# Altium schematic sheet JQ6500-16P-V1.3.SchDoc
size A3
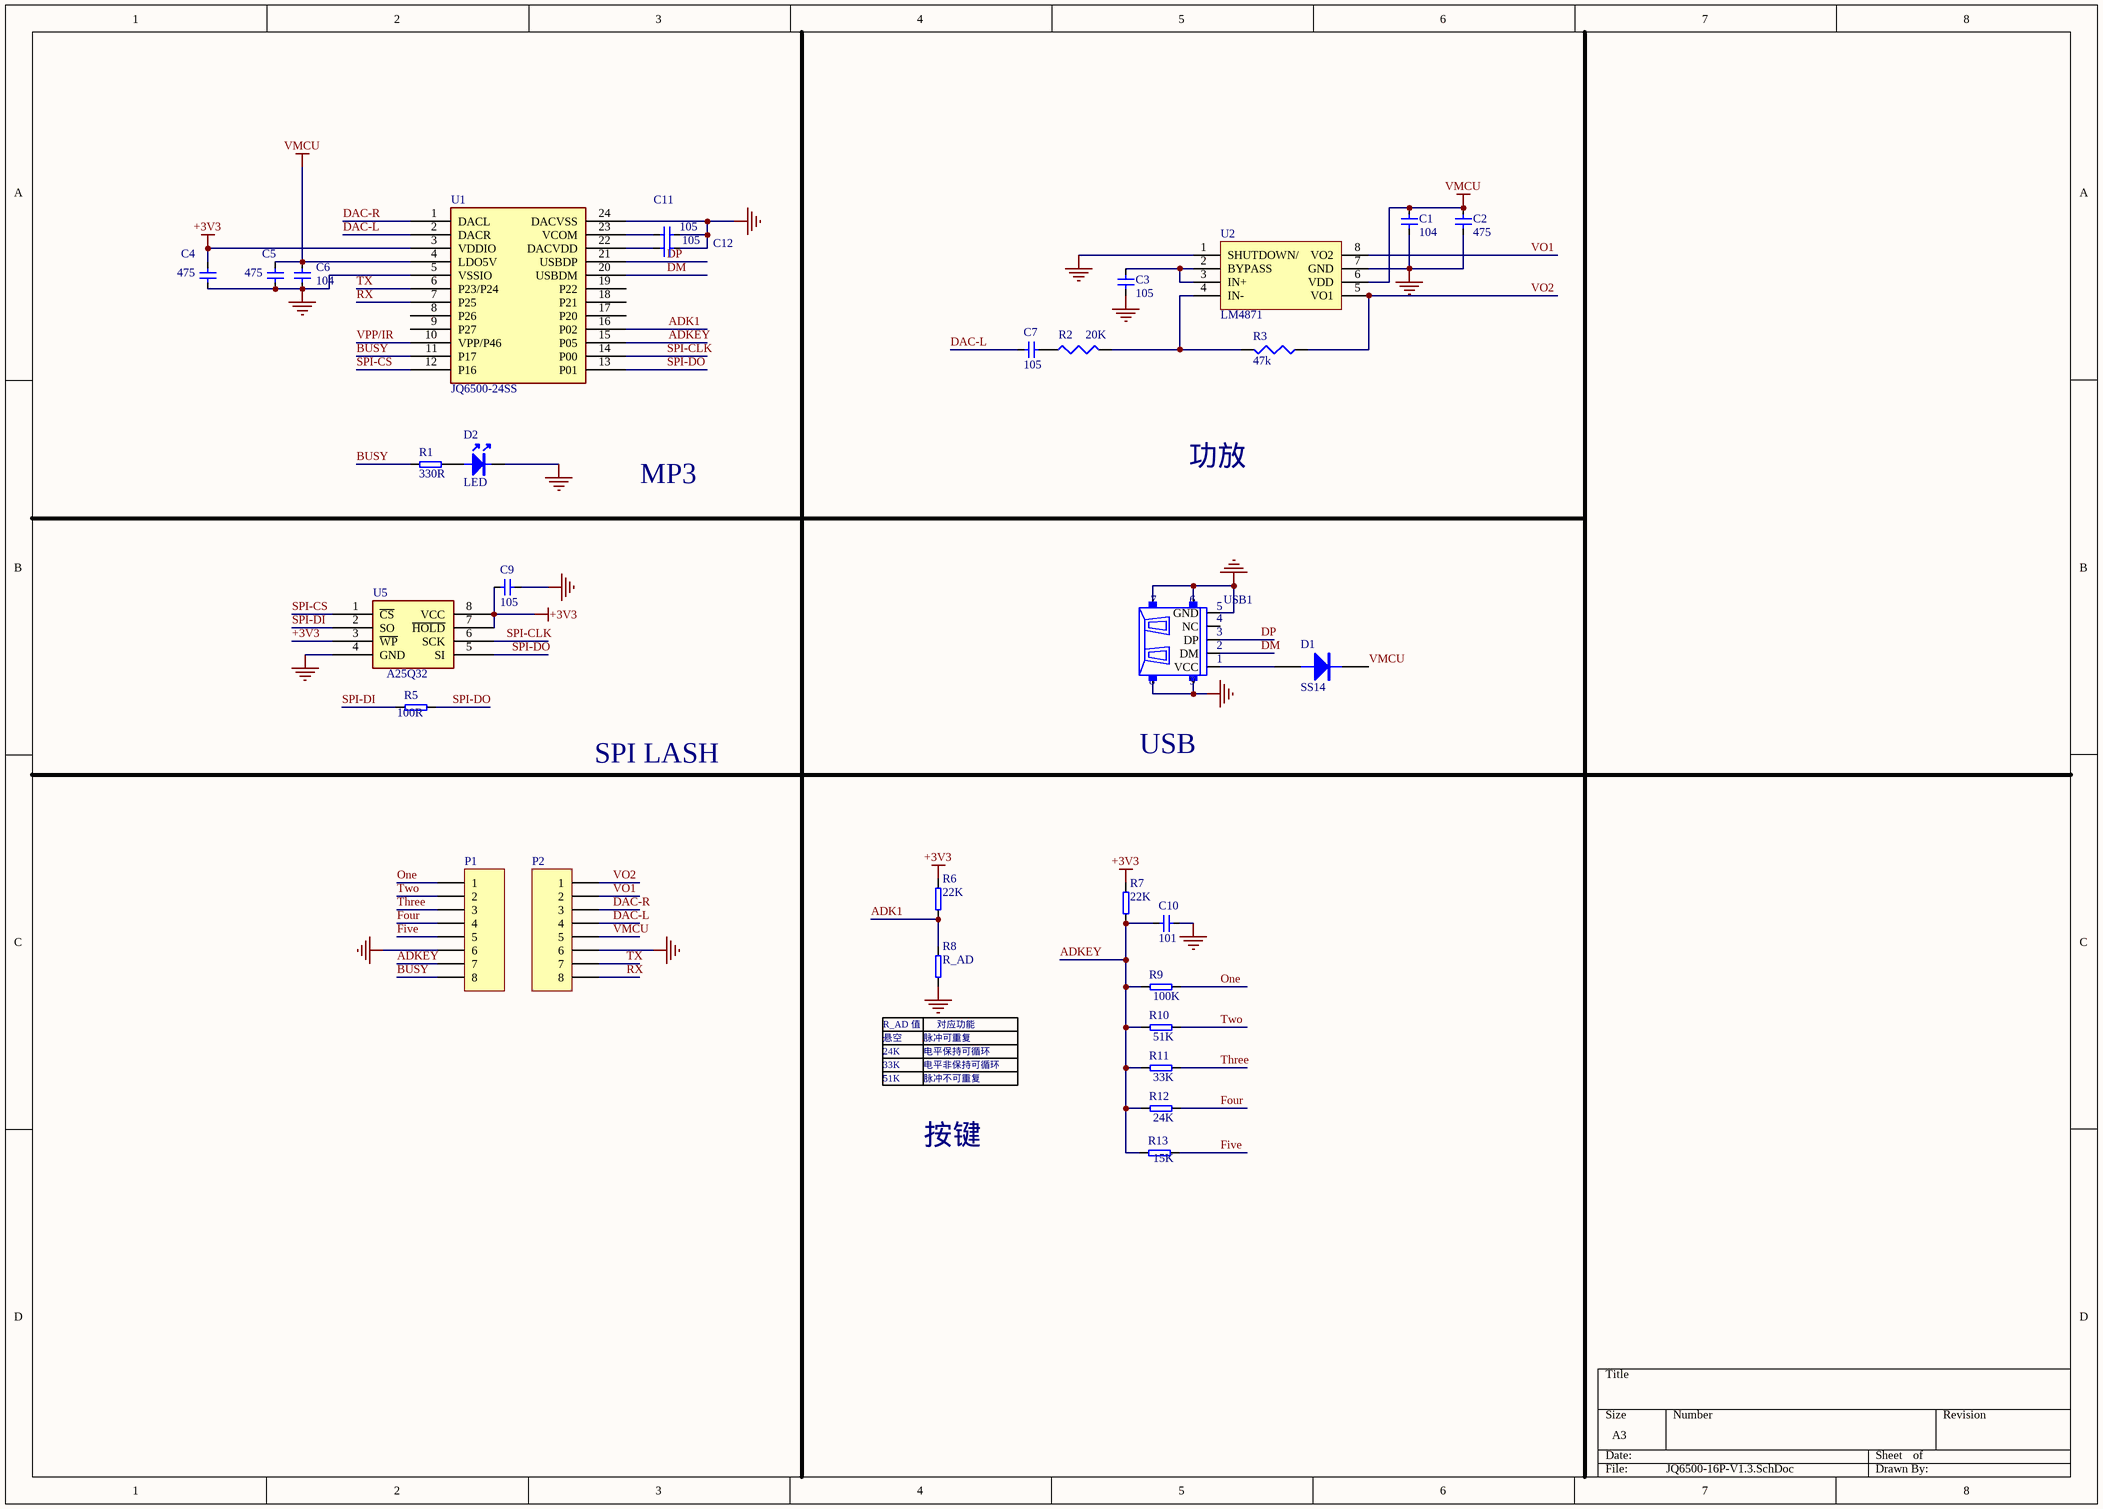
[diagram p0: JQ6500-16P-V1.3.SchDoc]

## Parts
C1  104  [C0603]
C2  475  [C0603]
C3  105  [C0603]
C4  475  [C0603]
C5  475  [C0603]
C6  104  [C0603]
C7  105  [C0603]
C9  105  [C0603]
C10  101  [C0603]
C11  105  [C0603]
C12  105  [C0603]
D1  SS14  [SOD123-1]
D2  LED  [0603]
P1  Header 8  [HDR1X8]  (value not drawn)
P2  Header 8  [HDR1X8]  (value not drawn)
R1  330R  [R0603]
R2  20K  [R0603]
R3  47k  [R0603]
R5  100R  [R0603]
R6  22K  [R0603]
R7  22K  [R0603]
R8  R_AD  [R0603]
R9  100K  [R0603]
R10  51K  [R0603]
R11  33K  [R0603]
R12  24K  [R0603]
R13  15K  [R0603]
U1  JQ6500-24SS  [SSOP24]
U2  LM4871  [SOP_8]
U5  A25Q32  [W25X16]
USB1  USB-5PIN  [USB-5PIN]  (value not drawn)

## Nets
+3V3: C4.1 C9.1 R6.2 R7.2 U1.3(VDDIO) U5.3(~{WP}) U5.7(~{HOLD}) U5.8(VCC)
GND: C1.1 C2.1 C3.1 C4.2 C5.2 C6.2 C9.2 C10.1 C11.2 C12.1 D2.2 P1.6 P2.6 R8.1 U1.5(VSSIO) U1.24(DACVSS) U2.1(SHUTDOWN/) U2.7(GND) U5.4(GND) USB1.5(GND) USB1.6 USB1.7 USB1.8 USB1.9
VMCU: C1.2 C2.2 C5.1 C6.1 D1.2(K) P2.5 U1.4(LDO5V) U2.6(VDD)
ADK1: R6.1 R8.2 U1.16(P02)
ADKEY: C10.2 P1.7 R7.1 R9.2 R10.2 R11.2 R12.2 R13.2 U1.15(P05)
BUSY: P1.8 R1.2 U1.11(P17)
DAC-L: C7.1 P2.4 U1.2(DACR)
DAC-R: P2.3 U1.1(DACL)
DM: U1.20(USBDM) USB1.2(DM)
DP: U1.21(USBDP) USB1.3(DP)
Five: P1.5 R13.1
Four: P1.4 R12.1
One: P1.1 R9.1
RX: P2.8 U1.7(P25)
SPI-CLK: U1.14(P00) U5.6(SCK)
SPI-CS: U1.12(P16) U5.1(~{CS})
SPI-DI: R5.2 U5.2(SO)
SPI-DO: R5.1 U1.13(P01) U5.5(SI)
Three: P1.3 R11.1
Two: P1.2 R10.1
TX: P2.7 U1.6(P23/P24)
VO1: P2.2 U2.8(VO2)
VO2: P2.1 R3.1 U2.5(VO1)
VPP/IR: U1.10(VPP/P46)
NetC3_2: C3.2 U2.2(BYPASS) U2.3(IN+)
NetC7_2: C7.2 R2.1
NetC11_1: C11.1 U1.23(VCOM)
NetC12_2: C12.2 U1.22(DACVDD)
NetD1_1: D1.1(A) USB1.1(VCC)
NetD2_1: D2.1 R1.1
NetR2_2: R2.2 R3.2 U2.4(IN-)

Not connected (* = marked no-connect by the designer): U1 8(P26) 9(P27) 17(P20) 18(P21) 19(P22); USB1 4(NC)

## Notes on the sheet
- MP3
- 功放
- SPI LASH
- USB
- (near R8) R_AD 值
- 悬空
- 24K
- 脉冲可重复
- 电平保持可循环
- (near R8) 对应功能
- 33K
- 51K
- 电平非保持可循环
- 脉冲不可重复
- 按键

## Library data of the parts
C1-C7 C9-C12 = CAP: Capacitor
D1 = DIODE
P1 P2 = Header 8: Header, 8-Pin; LatestRevisionDate: 17-Jul-2002; LatestRevisionNote: Re-released for DXP Platform.; Publisher: Altium Limited
R1 R5-R13 = RES
R2 R3 = Res3: 0805.PcbLib; Published: 8-Jun-2000; LatestRevisionDate: 17-Jul-2002; LatestRevisionNote: Re-released for DXP Platform.; Publisher: Altium Limited
U1 = AC1094
U2 = LM4890